# EAGLE design M18_36_Potis (EAGLE 6.1)

## Sheet 1 of 2
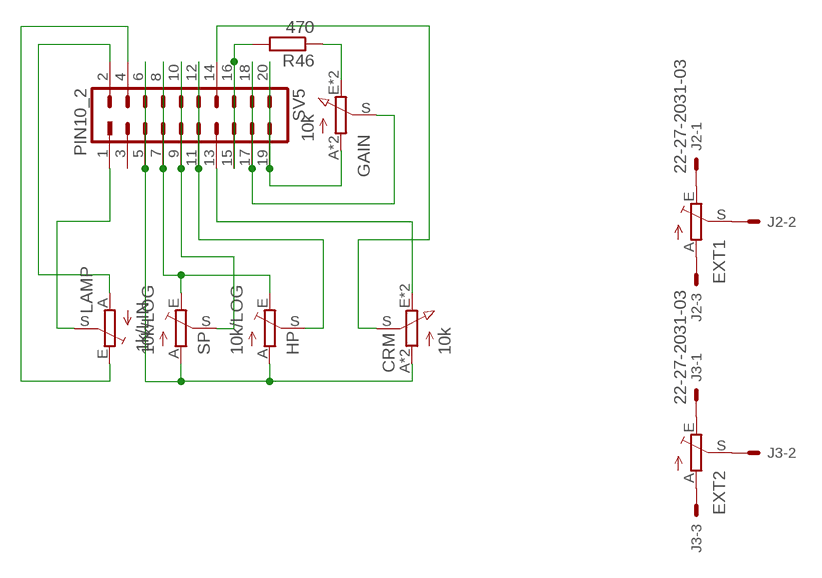
[diagram p0: schematic, sheet 1]

### Parts
CRM  10k  P_EUPT10+15_K  [P_PT-10+15_KIEMELT]
EXT1  TRIM_EU-PT10  [PT-10]
EXT2  TRIM_EU-PT10  [PT-10]
GAIN  10k  P_EUPT10+15_K  [P_PT-10+15_KIEMELT]
HP  10k/LOG  TRIM_EU-POT_WHOLE  [POT_NAR]
J2  22-27-2031-03  [6410-03]
J3  22-27-2031-03  [6410-03]
LAMP  1k/LIN  TRIM_EU-POT_WHOLE  [POT_NAR]
R46  470  R-EU_R0805  [R0805]
SP  10k/LOG  TRIM_EU-POT_WHOLE  [POT_NAR]
SV5  PIN10_2  [PIN10_2]

### Nets
N$10: CRM.E CRM.E1(E) SV5.13
N$11: CRM.A CRM.A1(A) HP.A SP.A SV5.5 SV5.6
N$30: HP.E SP.E SV5.7 SV5.8
N$33: SP.S SV5.9 SV5.10
N$37: EXT1.S J2.2
N$38: EXT2.S J3.2
N$41: EXT1.E J2.1
N$42: EXT1.A J2.3
N$43: LAMP.S SV5.1
N$44: EXT2.A J3.3
N$45: EXT2.E J3.1
N$47: LAMP.E SV5.4
N$48: HP.S SV5.11 SV5.12
N$56: LAMP.A SV5.2
N$58: CRM.S SV5.14
N$68: R46.2 SV5.15 SV5.16
N$69: GAIN.S SV5.17 SV5.18
N$70: GAIN.A GAIN.A1(A) SV5.19 SV5.20
N$73: GAIN.E GAIN.E1(E) R46.1
Unconnected: SV5.3

## Sheet 2 of 2

## Library data of the parts
CRM GAIN = Cf_RLCPX:P_EU
EXT1 EXT2 HP LAMP SP = pot:TRIM_EU-: POTENTIOMETER
J2 J3 = con-molex:22-?-03: CONNECTOR wire to board 2.54 mm (.1 inch) pitch header; OC_FARNELL: unknown; OC_NEWARK: unknown
R46 = rcl:R-EU_: RESISTOR, European symbol
SV5 = Cf_Csatl:PIN10_2

## Net classes
0 default: width 0.305 mm, clearance 0.305 mm

## Board
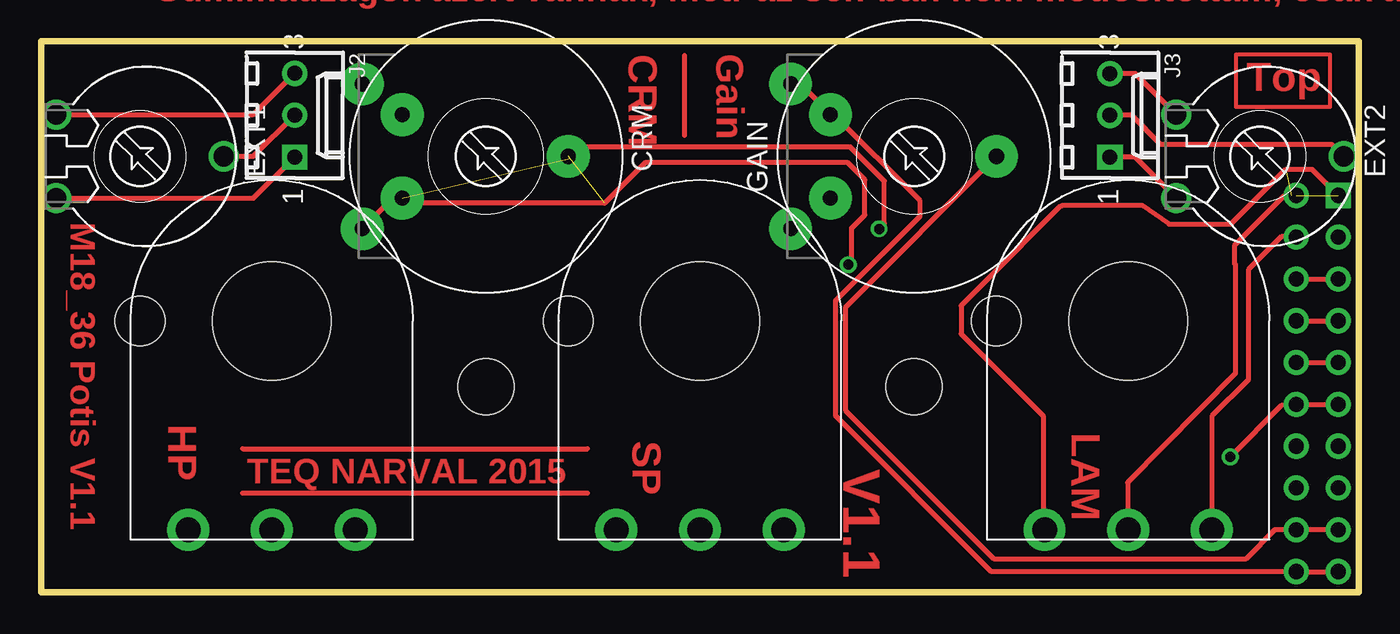
[diagram p1: board, top side]
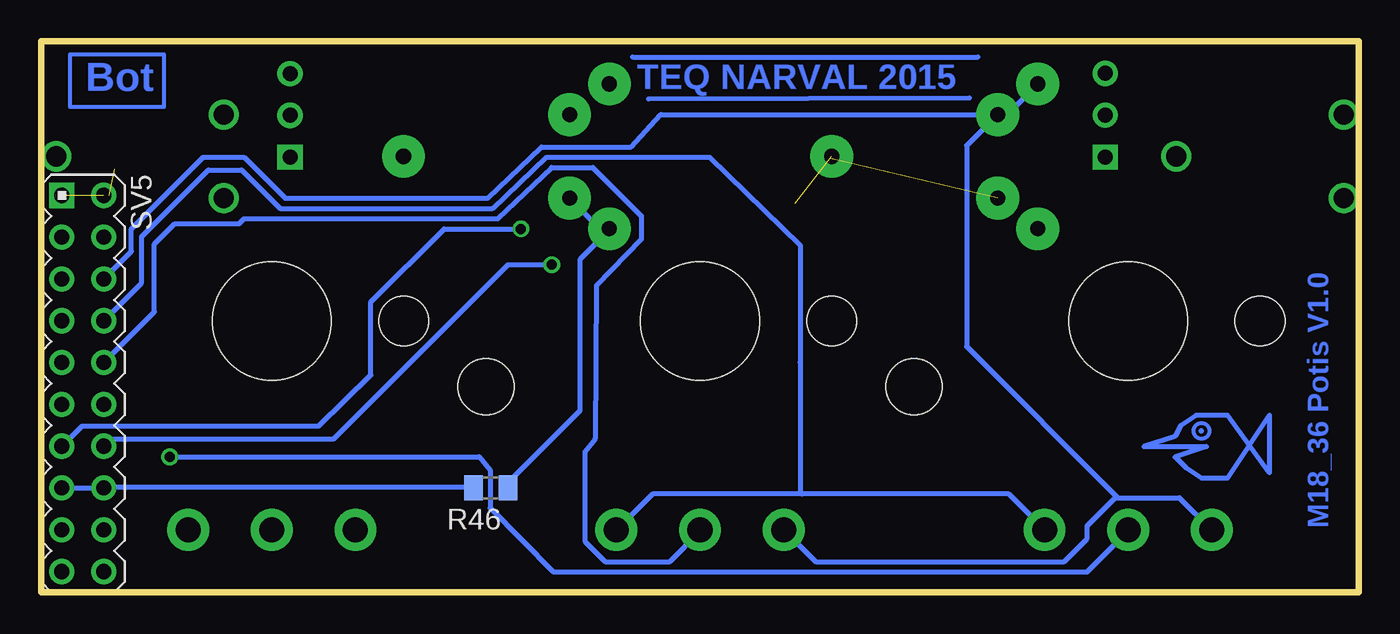
[diagram p2: board, bottom side, seen from below]

Size 80 x 33.5 mm. Coordinates in mm from the lower left corner, seen from the top.
Outline: 80,0 0,0 0,33.5 80,33.5 80,0
Copper layers (1*16): Top 0.035mm / dielectric 1.5mm / Bottom 0.035mm
Design rules "default": minimum track width 10mil, minimum drill 24mil, track to track 12mil, track to pad 12mil, pad to pad 12mil, via to via 12mil, smd to smd 10mil, copper to edge 10mil, drill to drill 10mil, minimum pad ring 10mil, minimum via ring 8mil, stop-mask expansion 4mil, vias tented up to drill 0mil, thermal gap 10mil
Holes 3.4 mm at 27,12.5 53,12.5
Holes 3 mm at 6,16.5 32,16.5 58,16.5
Holes 7.2 mm at 14,16.5 40,16.5 66,16.5
tRestrict: area 23.5,9 to 30.5,16; area 49.5,9 to 56.5,16; area 8.2,10.7 to 19.8,22.3; area 34.2,10.7 to 45.8,22.3; area 60.2,10.7 to 71.8,22.3
bRestrict: area 23.5,9 to 30.5,16; area 49.5,9 to 56.5,16; area 8.2,10.7 to 19.8,22.3; area 34.2,10.7 to 45.8,22.3; area 60.2,10.7 to 71.8,22.3

### Footprints (pad centres in the part's own frame; a part is rotated, then mirrored left to right if it is on the bottom)
P_PT-10+15_KIEMELT = drill 0.914 pad 2.6: A -4.4,-7.5; A1 -2.54,-5.08; E 4.4,-7.5; E1 2.54,-5.08; S 0,5
PT-10 = drill 1.219: A -2.54,-5.08; E 2.54,-5.08; S 0,5.08
POT_NAR = drill 1.524 pad 2.54: A -5.08,-12.7; E 5.08,-12.7; S 0,-12.7
6410-03 = drill 0.914 pad 1.524 square: 1 2.54,0 | drill 0.914 pad 1.524: 2 0,0; 3 -2.54,0
R0805 = smd 1.1 x 1.5: 1 -1.05,0; 2 1.05,0
PIN10_2 = drill 0.914 pad 1.524 square: 1 -10.16,0 | drill 0.914 pad 1.524: 2 -10.16,2.54; 3 -7.62,0; 4 -7.62,2.54; 5 -5.08,0; 6 -5.08,2.54; 7 -2.54,0; 8 -2.54,2.54; 9 0,0; 10 0,2.54; 11 2.54,0; 12 2.54,2.54; 13 5.08,0; 14 5.08,2.54; 15 7.62,0; 16 7.62,2.54; 17 10.16,0; 18 10.16,2.54; 19 12.7,0; 20 12.7,2.54

### Placement (x,y rotation side)
CRM  27,26.5 270 top
EXT1  6,26.5 270 top
EXT2  74,26.5 270 top
GAIN  53,26.5 270 top
HP  14,16.5 0 top
J2  15.39,29 270 top
J3  64.89,28.99 270 top
LAMP  66,16.5 0 top
R46  52.7,6.35 180 bottom
SP  40,16.5 0 top
SV5  78.74,13.97 270 bottom

### Tracks (layer width: path | path; a pad name or v marks a point on that pad's centre or on a via)
HALACSKA3
  Bottom 0.305: 5.43,10.77 5.43,7.27 7.97,10.77 9.88,10.77 10.83,10.13 11.15,9.5 13.05,8.86 9.24,8.86 11.15,8.23 10.51,7.59 9.56,6.96 7.97,6.96 5.43,10.77
N$1
  Top 0.305: 12.23,8.72 33.18,8.72
N$2
  Top 0.305: 33.18,6.03 12.23,6.03
N$3
  Top 0.305: 39.05,32.62 39.05,27.78
N$10  (via drill 0.61)  (1 unrouted)
  Top 0.305: CRM.E1 21.36,23.96 CRM.E | v50.87,22.09 51.2,22.42 51.2,25 49.13,27.07 32.86,27.07 32.15,26.35 32.07,26.35
  Bottom 0.305: SV5.13 77.52,10.11 63.15,10.11 59.98,13.21 59.98,17.66 55.54,22.09 v50.87,22.09
N$11
  Top 0.305: SV5.6 SV5.5 78.81,19.05 78.88,18.98
  Bottom 0.305: SV5.6 74.52,20.73 74.52,22.09 70.16,26.45 67.67,26.45 65.19,23.96 52.9,23.96 49.63,27.06 44.19,27.06 42.37,29.04 CRM.A1 | SP.A 32.99,1.87 17.89,1.87 16.49,3.27 16.49,4.04 14.78,5.76 14.62,5.76 | 14.62,5.76 10.89,5.76 8.93,3.8 HP.A | CRM.A 21.36,29.04 CRM.A1 | CRM.A1 23.81,27.15 23.81,14.94 14.62,5.76
N$14
  Bottom 0.305: 44.09,32.52 23.13,32.52
N$15
  Bottom 0.305: 23.64,30.05 43.14,29.98
N$30
  Top 0.305: SV5.8 SV5.7
  Bottom 0.305: SV5.8 73.9,18.81 73.9,21.62 69.85,25.67 67.83,25.67 65.5,23.34 52.58,23.34 49.32,26.44 39.4,26.44 33.91,21.12 33.91,14 33.92,6.06 33.82,5.98 42.86,5.99 | 42.86,5.99 45.05,3.8 | 45.05,3.8 45.12,3.73 | HP.E 21.27,5.99 42.86,5.99 | SP.E 45.05,3.8
N$33
  Top 0.305: SV5.10 SV5.9
  Bottom 0.305: SV5.10 73.12,17.05 73.12,21.16 71.88,22.4 67.99,22.4 67.67,22.71 52.27,22.71 49.01,25.82 46.5,25.82 43.56,22.87 43.56,21.47 46.29,18.66 46.37,9.33 46.98,8.56 46.98,3.11 45.74,1.87 41.85,1.87 39.98,3.73 39.98,3.78 SP.S
N$37
  Top 0.305: EXT1.S 12.89,26.5 J2.2
N$38
  Top 0.305: EXT2.S 78.35,27.23 67.99,27.23 66.22,28.99 J3.2
N$41
  Top 0.305: EXT1.E 12.89,23.96 J2.1
N$42
  Top 0.305: EXT1.A 12.89,29.04 J2.3
N$43  (1 unrouted)
  Top 0.305: 65.96,3.76 65.96,6.69 72.51,13.31 72.51,19.93 72.47,19.93 72.47,21.11 75.49,24.13 76.2,24.13 | 65.96,3.73 65.96,3.76 | 65.96,3.76 LAMP.S
N$44
  Top 0.305: EXT2.A 66.43,31.53 J3.3
N$45
  Top 0.305: EXT2.E 66.43,26.45 J3.1
N$47
  Top 0.305: SV5.4 76.17,21.62 75.3,21.62 73.29,19.61 73.29,12.93 71.08,10.72 LAMP.E
N$48  (via drill 0.61)
  Top 0.305: v72.19,8.24 75.31,11.36 SV5.12 SV5.11
  Bottom 0.305: v72.19,8.24 53.41,8.24 52.74,7.42 52.74,5.13 48.9,1.25 16.49,1.25 14,3.74 HP.S
N$56  (1 unrouted)
  Top 0.305: SV5.2 75.88,24.13 | 60.83,3.71 60.83,10.73 55.85,15.71 55.85,17.42 57.25,18.82 61.81,23.43 61.97,23.51 66.88,23.51 68.46,22.4 68.48,22.38 72.23,22.38 75.56,25.72 77.15,25.72 78.74,24.13 | 60.83,3.58 60.83,3.71 | 60.83,3.71 LAMP.A
N$58  (via drill 0.61)  (1 unrouted)
  Top 0.305: 22.07,23.34 22.07,23.65 | 22.07,23.65 22.23,23.81 23.02,23.81 | v49.01,19.91 49.21,20.12 49.21,22.15 50.01,22.94 50.01,25.08 48.97,26.11 36.67,26.11 34.21,23.65 22.07,23.65
  Bottom 0.305: SV5.14 75.75,9.34 62.23,9.34 51.65,19.91 v49.01,19.91
N$68
  Bottom 0.305: R46.2 53.94,6.38 76.08,6.38 | 76.08,6.38 76.23,6.38 | SV5.15 SV5.16 76.11,6.35 76.08,6.38
N$69
  Top 0.305: GAIN.S 48.85,17.35 48.85,11.05 57.87,2.03 73.12,2.03 74.91,3.81 SV5.18 SV5.17
N$70
  Top 0.305: SV5.19 SV5.20 57.69,1.27 48.23,10.73 48.23,17.74 53.36,22.87 53.36,23.8 48.07,29.09 47.97,29.09 GAIN.A1 47.92,29.09 | GAIN.A 46.11,30.9 47.92,29.09 | 47.92,29.09 48.07,28.94
N$73
  Bottom 0.305: GAIN.E1 46.05,22.09 GAIN.E | R46.1 51.77,6.5 51.81,6.53 47.3,11.05 47.3,20.23 45.43,22.09 GAIN.E | GAIN.E
N$96
  Bottom 0.254: 72.54,29.51 72.54,32.68 78.25,32.68 78.25,29.51 72.54,29.51
N$103
  Top 0.254: 78.25,29.51 78.25,32.68 72.54,32.68 72.54,29.51 78.25,29.51
(copper drawn outside any net)
  shapes: Bottom circle x2

### Text on the board
Top: Figyelem a 3db 7.2mm-es luk belső marás! | 1.1-nek minősül,de a fájlnevet nem változtattuk meg | Gumimadzagok azért vannak, metr az sch-ban nem módosítottam, csak a nyákon (2016 03 31) | CRM | Gain | Top | M18_36 Potis V1.1 | HP | LAM | SP | V1.1 | TEQ NARVAL 2015
Bottom: TEQ NARVAL 2015 | Bot | M18_36 Potis V1.0